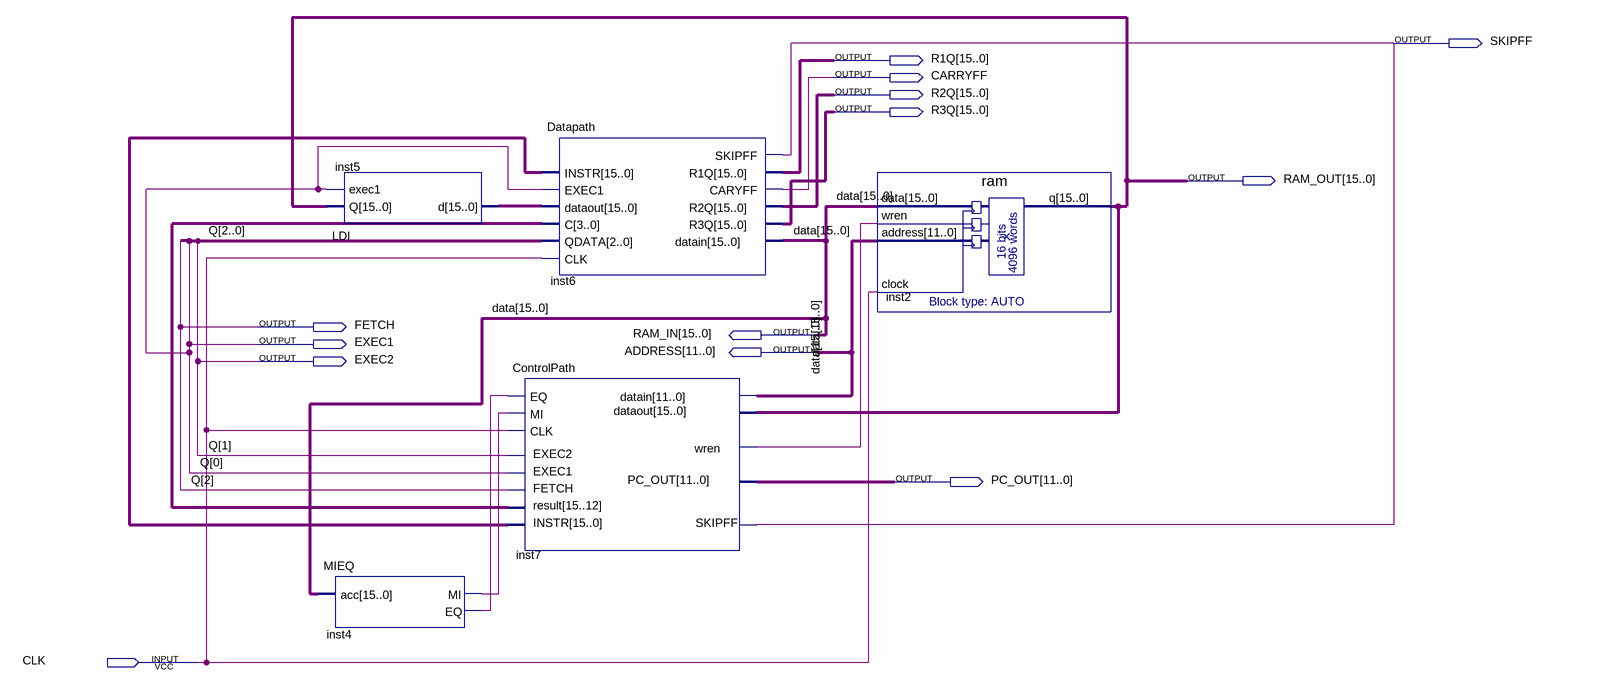
[diagram p0: schematic sheet]
// Quartus schematic MU0CPU.bdf as structural Verilog: 5 symbols, 13 pins
module MU0CPU (
  input  CLK,
  output SKIPFF,
  output [15:0] R1Q,
  output CARRYFF,
  output [15:0] R2Q,
  output [15:0] R3Q,
  output [15:0] RAM_OUT,
  output FETCH,
  output [15:0] RAM_IN,
  output EXEC1,
  output [11:0] ADDRESS,
  output EXEC2,
  output [11:0] PC_OUT
);

  wire inst4_eq, inst4_mi, inst7_wren;
  wire [3:0] inst7_result;
  wire [15:0] inst5_d, inst7_instr;

  LDI inst5 (.Q(RAM_OUT), .exec1(EXEC1), .d(inst5_d));
  MIEQ inst4 (.acc(RAM_IN), .MI(inst4_mi), .EQ(inst4_eq));
  ControlPath inst7 (
    .SKIPFF(SKIPFF), .EQ(inst4_eq), .MI(inst4_mi), .CLK(CLK), .dataout(RAM_OUT), .PC_OUT(PC_OUT),
    .EXEC1(EXEC1), .EXEC2(EXEC2), .FETCH(FETCH), .result(inst7_result), .wren(inst7_wren),
    .INSTR(inst7_instr), .datain(ADDRESS));
  Datapath inst6 (
    .CLK(CLK), .INSTR(inst7_instr), .EXEC1(EXEC1), .C(inst7_result), .QDATA({FETCH, EXEC2, EXEC1}),
    .dataout(inst5_d), .SKIPFF(SKIPFF), .R1Q(R1Q), .CARYFF(CARRYFF), .R2Q(R2Q), .R3Q(R3Q), .datain(RAM_IN));
  ram inst2 (.data(RAM_IN), .wren(inst7_wren), .address(ADDRESS), .clock(CLK), .q(RAM_OUT));

  // Other names for the same wires on the sheet: Q[2:0] = {FETCH, EXEC2, EXEC1}; data[15:0] = RAM_IN
endmodule
